# Altium project EC-Meter_v1.0.PrjPCB
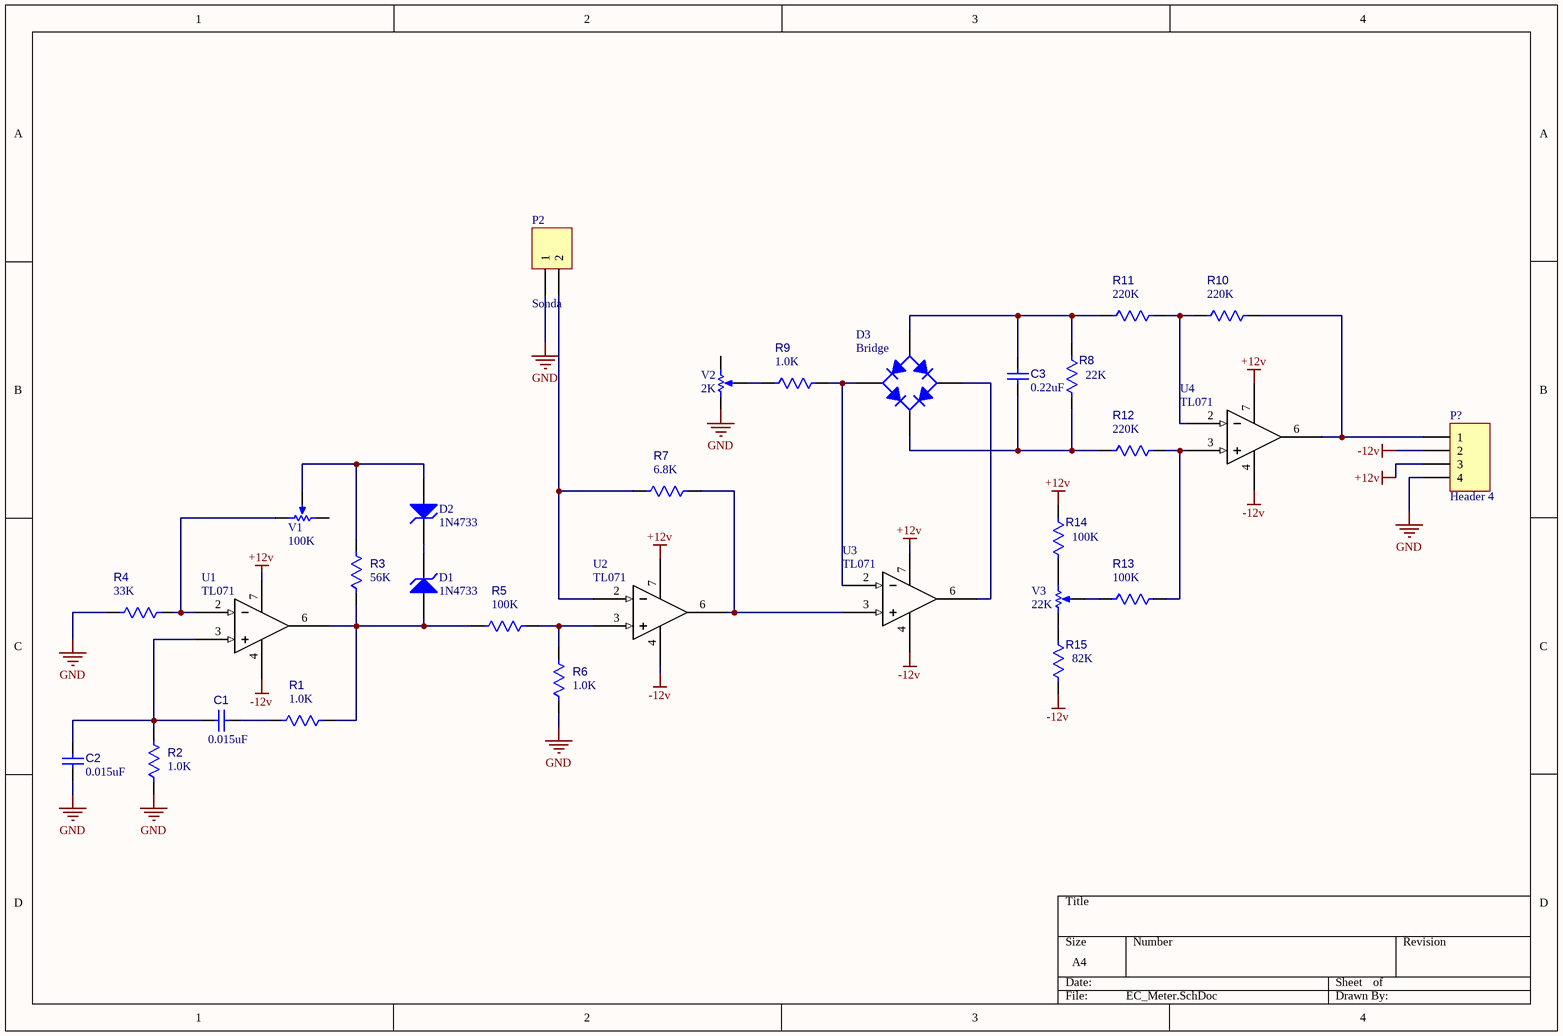
[diagram p0: EC_Meter.SchDoc]
1 sheet, 30 parts. Net scope: global (net labels, ports and power ports of the same name join across sheets).
Board file: PCB_v1.0.PcbDoc

## Sheet EC_Meter.SchDoc
size A4

### Parts
C1  0.015uF  [RAD-0.1]
C2  value 0.015uF  [RAD-0.1]  (hidden comment: Cap)
C3  value 0.22uF  [RAD-0.1]  (hidden comment: Cap)
D1  1N4733  [DIODE-0.4]
D2  1N4733  [DIODE-0.4]
D3  Bridge  [BRIDGE_W]
P2  Sonda  [HDR1X2]
P?  Header 4  [MOLEX4]
R1  1.0K  [AXIAL-0.3]
R2  1.0K  [AXIAL-0.3]
R3  56K  [AXIAL-0.3]
R4  33K  [AXIAL-0.3]
R5  100K  [AXIAL-0.3]
R6  1.0K  [AXIAL-0.3]
R7  6.8K  [AXIAL-0.3]
R8  22K  [AXIAL-0.3]
R9  1.0K  [AXIAL-0.3]
R10  220K  [AXIAL-0.3]
R11  220K  [AXIAL-0.3]
R12  220K  [AXIAL-0.3]
R13  100K  [AXIAL-0.3]
R14  100K  [AXIAL-0.3]
R15  82K  [AXIAL-0.3]
U1  TL071  [DIP-8]
U2  TL071  [DIP-8]
U3  TL071  [DIP-8]
U4  TL071  [DIP-8]
V1  100K  [TB-3x200]
V2  2K  [TB-3x200]
V3  22K  [TB-3x200]

### Nets
+12v: P?.3 R14.2 U1.7(+Vcc) U2.7(+Vcc) U3.7(+Vcc) U4.7(+Vcc)
-12v: P?.2 R15.1 U1.4(-Vcc) U2.4(-Vcc) U3.4(-Vcc) U4.4(-Vcc)
GND: C2.2 P2.1 P?.4 R2.2 R4.1 R6.2 V2.1(TOP)
NetC1_1: C1.1 C2.1 R2.1 U1.3(+)
NetC1_2: C1.2 R1.1
NetC3_1: C3.1 D3.3(A) R8.2 R11.1
NetC3_2: C3.2 D3.1(K) R8.1 R12.1
NetD1_1: D1.1(A) R1.2 R3.2 R5.1 U1.6(output)
NetD1_2: D1.2(K) D2.2(K)
NetD2_1: D2.1(A) R3.1 V1.2(TAP)
NetD3_2: D3.2(C) R9.2 U3.2(-)
NetD3_4: D3.4(C) U3.6(output)
NetP2_2: P2.2 R7.1 U2.2(-)
NetP?_1: P?.1 R10.2 U4.6(output)
NetR4_2: R4.2 U1.2(-) V1.3(BOT)
NetR5_2: R5.2 R6.1 U2.3(+)
NetR7_2: R7.2 U2.6(output) U3.3(+)
NetR9_1: R9.1 V2.2(TAP)
NetR10_1: R10.1 R11.2 U4.2(-)
NetR12_2: R12.2 R13.2 U4.3(+)
NetR13_1: R13.1 V3.2(TAP)
NetR14_1: R14.1 V3.3(BOT)
NetR15_2: R15.2 V3.1(TOP)

Not connected (* = marked no-connect by the designer): V1 1(TOP); V2 3(BOT)

### Library data of the parts
C1-C3 = Cap: Tolerance: ±10%; Voltage-Rated: 50V; Package: 0603
  C1: Value: 0.015uF
D1 D2 = D Zener: Zener Diode 3.3v; Published: 8-Jun-2000; LatestRevisionDate: 17-Jul-2002; LatestRevisionNote: Re-released for DXP Platform.; PackageReference: DIODE-0.7; Publisher: Altium Limited; PackageDescription: Diode, Thru-Hole; 2 Leads; 0.7 in Pin Spacing
D3 = Bridge: Full Wave Diode Bridge; Published: 8-Jun-2000; LatestRevisionDate: 29-May-2009; LatestRevisionNote: Sch pins A & K swapped.; DatasheetVersion: E2732B; PackageReference: D-38; Publisher: Altium Limited; PackageDescription: Bridge Rectifier; 4 Terminals; Body 9.4 x 9.4 mm (typ); Pitch 5.08 mm
P2 = Header 2: Header, 2-Pin; LatestRevisionDate: 17-Jul-2002; LatestRevisionNote: Re-released for DXP Platform.; Publisher: Altium Limited
P? = Header 4: Header, 4-Pin; LatestRevisionDate: 17-Jul-2002; LatestRevisionNote: Re-released for DXP Platform.; Publisher: Altium Limited
R1-R15 = Res: Resistor; Tolerance: 1%; Package: 0603
  R1 R2 R6 R9: Value: 1.0K
  R3: Value: 56K
  R4: Value: 33K
  R5 R13 R14: Value: 100K
  R7: Value: 6.8K
  R8: Value: 22K
  R10-R12: Value: 220K
  R15: Value: 82K
U1-U4 = TL071: Low-noise jfet-input operational amplifiers
V1-V3 = Preset: Potentiometer; Sim Note: Enter the Resistance value and the set point into parameter fields.; Set Position: 0.5; Published: 8-Jun-2000; LatestRevisionDate: 17-Jul-2002; LatestRevisionNote: Re-released for DXP Platform.; PackageReference: VR5; Publisher: Altium Limited; PackageDescription: Variable Resistor, Thru-Hole; 3 Leads
  V1: Value: 100K
  V2: Value: 2K
  V3: Value: 22K